# EAGLE design blocks-with-screens (EAGLE 9.1.2)
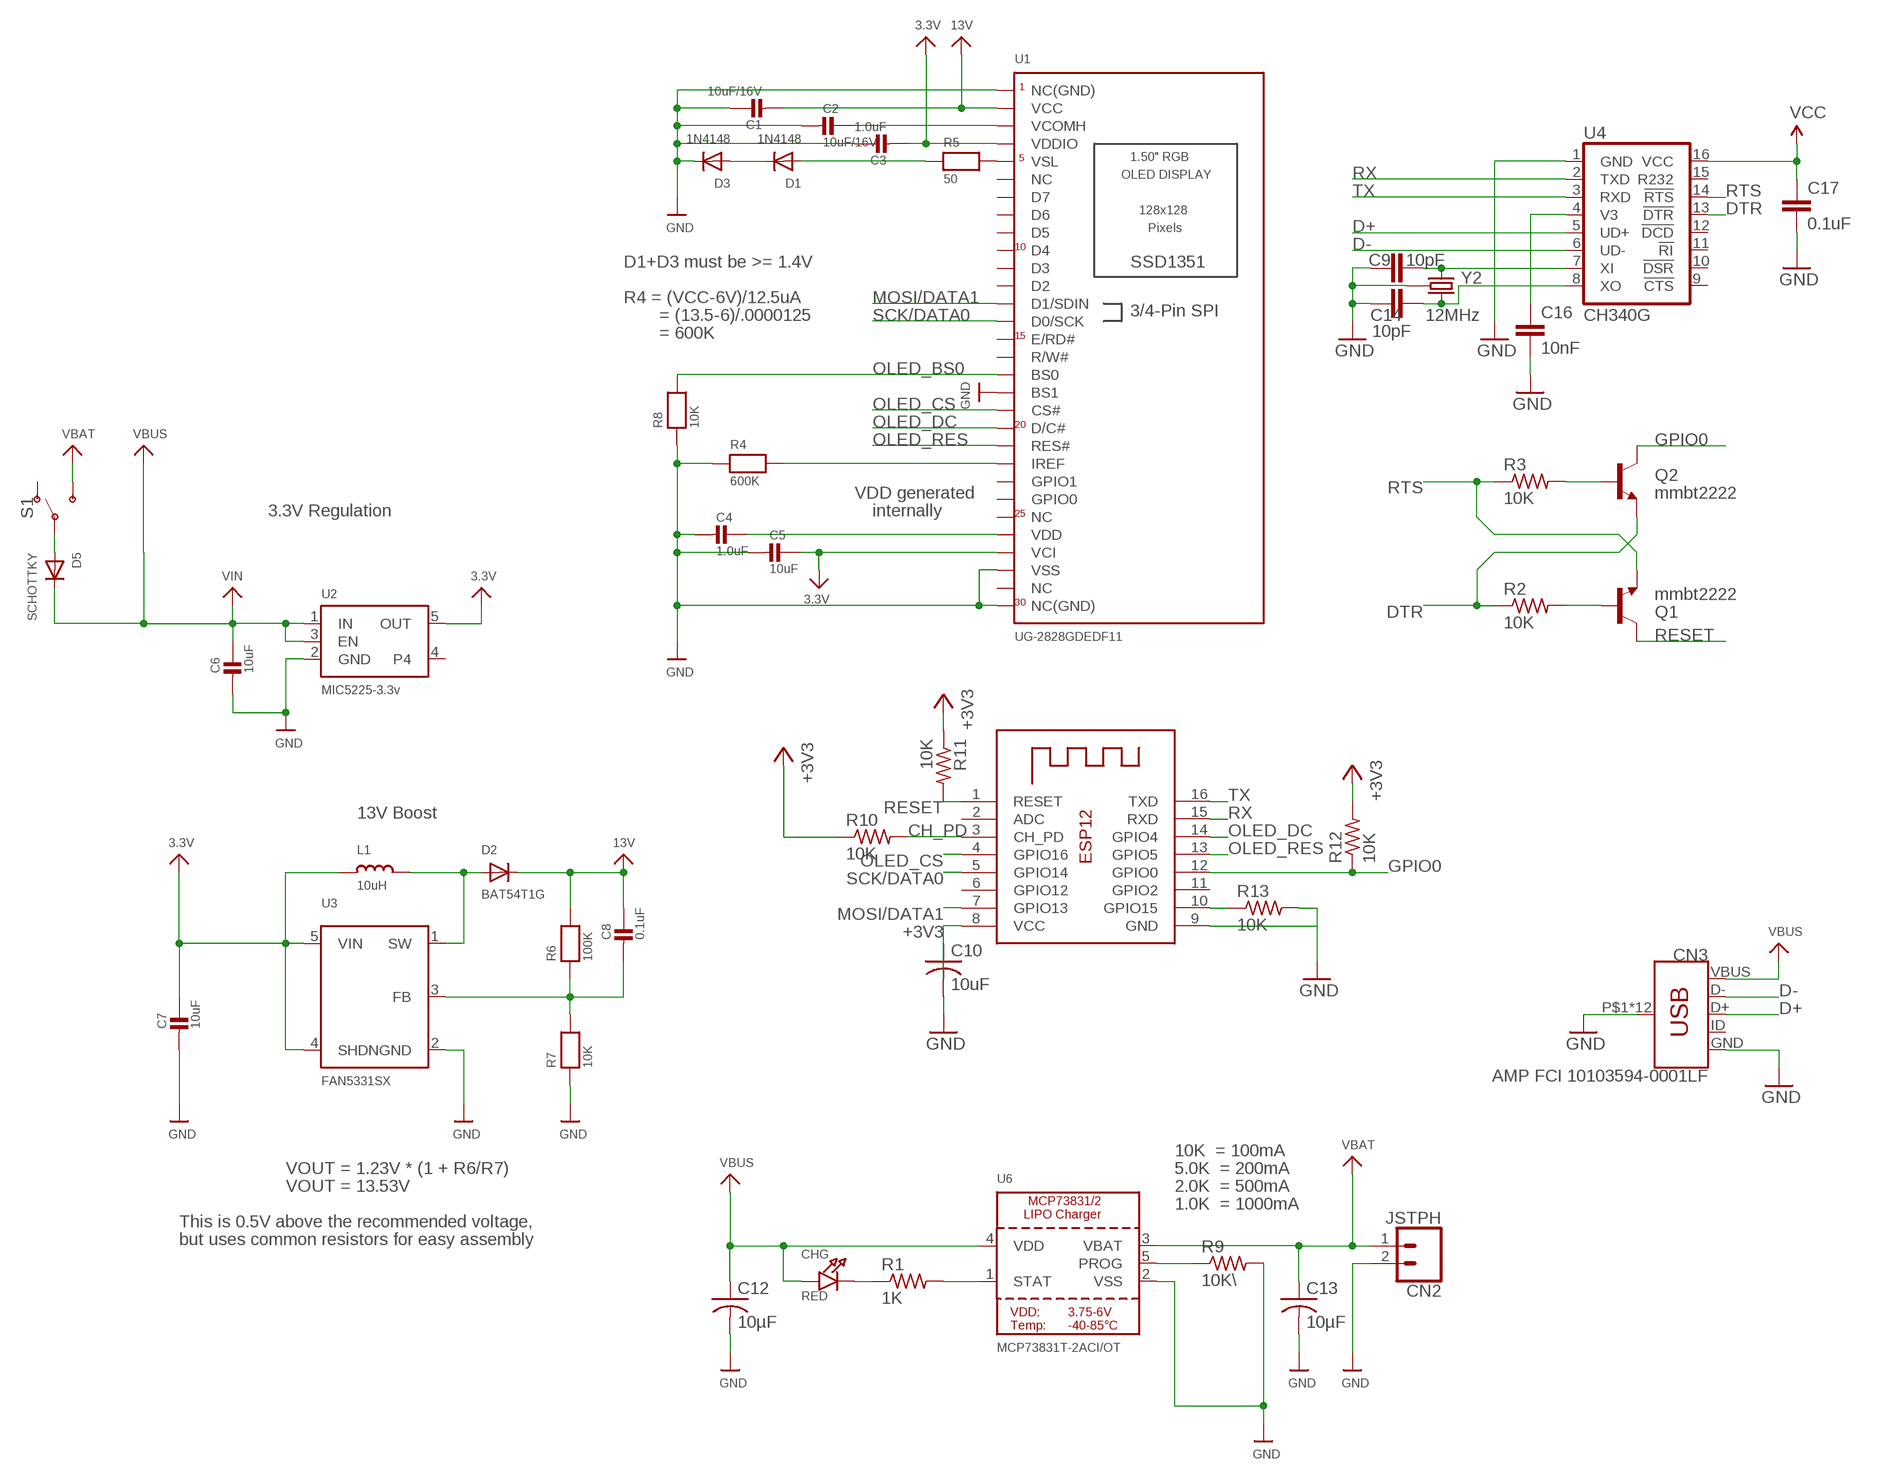
[diagram p0: schematic, sheet 1]

## Parts
C1  10uF/16V  CAP_CERAMIC0805  [0805]
C2  10uF/16V  CAP_CERAMIC0805  [0805]
C3  1.0uF  CAP_CERAMIC0805  [0805]
C4  1.0uF  CAP_CERAMIC0805  [0805]
C5  10uF  CAP_CERAMIC0805  [0805]
C6  10uF  CAP_CERAMIC0805  [0805]
C7  10uF  CAP_CERAMIC0805  [0805]
C8  0.1uF  CAP_CERAMIC0805  [0805]
C9  10pF  10PF-50V-5%(0603)  [0603-CAP]
C10  10uF  C-USC0805  [C0805]
C12  10µF  C-USC0805  [C0805]
C13  10µF  C-USC0805  [C0805]
C14  10pF  10PF-50V-5%(0603)  [0603-CAP]
C16  10nF  10NF/10000PF-50V-10%(0603)  [0603-CAP]
C17  0.1uF  0.1UF-25V(+80/-20%)(0603)  [0603-CAP]
CHG  RED  LED0805_NOOUTLINE  [CHIPLED_0805_NOOUTLINE]
CN2  JSTPH  CONN_02  [1X02]
CN3  AMP FCI 10103594-0001LF  USB_MICRO-B_HALF_PTH  [USB-MICROB-PTH]
D1  1N4148  DIODESOD-323  [SOD-323]
D2  BAT54T1G  DIODESOD-123  [SOD-123]
D3  1N4148  DIODESOD-323  [SOD-323]
D5  SCHOTTKY  DIODE_SOD-123FL  [SOD-123FL]
L1  10uH  INDUCTOR  [INDUCTOR_1007]
Q1  mmbt2222  TRANSISTOR_NPNSOT23-3  [SOT23-3]
Q2  mmbt2222  TRANSISTOR_NPNSOT23-3  [SOT23-3]
R1  1K  R-US_R0805  [R0805]
R2  10K  R-US_R0603  [R0603]
R3  10K  R-US_R0603  [R0603]
R4  600K  RESISTOR0805  [0805]
R5  50  RESISTOR0805  [0805]
R6  100K  RESISTOR0805  [0805]
R7  10K  RESISTOR0805  [0805]
R8  10K  RESISTOR0805  [0805]
R9  10K\  R-US_R0805  [R0805]
R10  10K  R-US_R0805  [R0805]
R11  10K  R-US_R0805  [R0805]
R12  10K  R-US_R0805  [R0805]
R13  10K  R-US_R0805  [R0805]
S1  SWITCH-SPDT-SMD-RIGHT-ANGLE  [SWITCH_SPST_SMD_A]
U1  UG-2828GDEDF11  DISP_OLED_UG-2828GDEDF11TOP  [FPC_XF2M-3015-1A]
U2  MIC5225-3.3v  VREG_SOT23-5  [SOT23-5]
U3  FAN5331SX  FAN5331  [SOT23-5@1]
U4  CH340G  CH340GSMD  [SO016]
U6  MCP73831T-2ACI/OT  MCP73831/2  [SOT23-5]
X1  ESP-12  [ESP-12]
Y2  12MHz  CRYSTAL-GROUNDED3.2X2.5  [CRYSTAL-SMD-3.2X2.5]

## Nets
3.3V: C3.2 C5.1 C7.1 L1.P$1 U1.P$4(VCI) U1.P$27(VDDIO) U2.5(OUT) U3.4(SHDN) U3.5(VIN)
13V: C1.2 C8.1 D2.C R6.2 U1.P$29(VCC)
+3V3 [power]: C10.1 R10.1 R11.1 R12.2 X1.8(VCC)
CH_PD: R10.2 X1.3(CH_PD)
D+: CN3.D+ U4.5(UD+)
D-: CN3.D- U4.6(UD-)
DTR: Q2.2(E) R2.1 U4.13(!DTR)
GND: C1.1 C2.2 C3.1 C4.2 C5.2 C6.2 C7.2 C9.1 C10.2 C12.2 C13.2 C14.1 C16.2 C17.2 CN2.2 CN3.GND CN3.P$1(SHIELD) CN3.P$2(SHIELD) CN3.P$3(SHIELD) CN3.P$4(SHIELD) CN3.P$6(SHIELD) CN3.P$8(SHIELD) CN3.P$10(SHIELD) CN3.P$12(SHIELD) CN3.SHEILD2(SHIELD) CN3.SHIELD CN3.SHIELD3(SHIELD) CN3.SHIELD4(SHIELD) D3.C R4.1 R7.1 R8.1 R9.2 R13.2 U1.P$1(NC(GND)) U1.P$3(VSS) U1.P$13(BS1) U1.P$30(NC(GND)) U2.2(GND) U3.2(GND) U4.1(GND) U6.2(VSS) X1.9(GND) Y2.2(GND) Y2.4(GND)
GPIO0: Q2.3(C) R12.1 X1.12(GPIO0)
IREF: R4.2 U1.P$9(IREF)
MOSI/DATA1: U1.P$18(D1/SDIN) X1.7(GPIO13)
N$1: CHG.C R1.1
N$3: C4.1 U1.P$5(VDD)
N$4: R1.2 U6.1(STAT)
N$5: D2.A L1.P$2 U3.1(SW)
N$6: R5.2 U1.P$26(VSL)
N$7: D1.A R5.1
N$8: C8.2 R6.1 R7.2 U3.3(FB)
N$9: R9.1 U6.5(PROG)
N$10: C14.2 U4.8(XO) Y2.3
N$11: D1.C D3.A
N$12: C9.2 U4.7(XI) Y2.1
N$13: Q1.1(B) R2.2
N$14: Q2.1(B) R3.2
N$17: R13.1 X1.10(GPIO15)
N$19 [power]: D5.A S1.2(P)
OLED_BS0: R8.2 U1.P$14(BS0)
OLED_CS: U1.P$12(CS#) X1.4(GPIO16)
OLED_DC: U1.P$11(D/C#) X1.14(GPIO4)
OLED_RES: U1.P$10(RES#) X1.13(GPIO5)
RESET: Q1.3(C) R11.2 X1.1(RESET)
RTS: Q1.2(E) R3.1 U4.14(!RTS)
RX: U4.2(TXD) X1.15(RXD)
SCK/DATA0: U1.P$17(D0/SCK) X1.5(GPIO14)
TX: U4.3(RXD) X1.16(TXD)
V3: C16.1 U4.4(V3)
VBAT [power]: C13.1 CN2.1 S1.3(S) U6.3(VBAT)
VBUS [power]: C6.1 C12.1 CHG.A CN3.VBUS D5.C U2.1(IN) U2.3(EN) U6.4(VDD) ; supply symbol labelled VIN
VCC: C17.1 U4.16(VCC)
VCOMH: C2.1 U1.P$28(VCOMH)
Unconnected: CN3.ID S1.1(O) U1.P$2(NC) U1.P$6(NC) U1.P$7(GPIO0) U1.P$8(GPIO1) U1.P$15(R/W#) U1.P$16(E/RD#) U1.P$19(D2) U1.P$20(D3) U1.P$21(D4) U1.P$22(D5) U1.P$23(D6) U1.P$24(D7) U1.P$25(NC) U2.4 U4.9(!CTS) U4.10(!DSR) U4.11(!RI) U4.12(!DCD) U4.15(R232) X1.2(ADC) X1.6(GPIO12) X1.11(GPIO2)

## Notes on the sheet
- D1+D3 must be >= 1.4V
- R4 = (VCC-6V)/12.5uA
- = (13.5-6)/.0000125
- = 600K
- VDD generated
- 3.3V Regulation | internally
- 13V Boost
- 10K  = 100mA
- VOUT = 1.23V * (1 + R6/R7) | 5.0K  = 200mA
- VOUT = 13.53V | 2.0K  = 500mA
- 1.0K  = 1000mA
- This is 0.5V above the recommended voltage,
- but uses common resistors for easy assembly

## Library data of the parts
C1-C8 = microbuilder:CAP_CERAMIC: Ceramic Capacitors For new designs, use the packages preceded by an '_' character since they are more reliable: The following footprints should be used on most boards: _0402 - Standard footprint for regular board layouts _0603 - Standard footprint for regular board layouts _0805 - Standard footprint for regular board layouts For extremely tight-pitch boards where space is at a premium, the following 'micro-pitch' footprints can be used (smaller pads, no silkscreen outline, etc.): _0402MP - Micro-pitch footprint for very dense/compact boards _0603MP - Micro-pitch footprint for very dense/compact boards _0805MP - Micro-pitch footprint for very dense/compact boards Commonly Stocked Parts 0402 - 0402 Surface Mount Capacitors 16pF 50V 5% [Digikey: 445-4899-2-ND] 18pF 50V 5% [Digikey: 490-1281-2-ND] 22pF 50V 5% [Digikey: 490-1283-2-ND] 68pF 50V 5% [Digikey: 490-1289-2-ND] 0.1uF 10V 10% [Digikey: 490-1318-2-ND] 1.0uF 6.3V 10% [Digikey: 490-1320-2-ND] 0603 - 0603 Surface Mount Capacitors 16 pF 50V 5% [Digikey: 445-5051-2-ND] 22 pF 50V [Digikey: PCC220ACVTR-ND] 33 pF 50V 5% [Digikey: 490-1415-1-ND] 56pF 50V 5% [Digikey: 490-1421-1-ND] 220pF 50V 5% [Digikey: 445-1285-1-ND] 680 pF 50V 2200 pF 50V 5% C0G [Digikey: 445-1297-1-ND] 5600 pF 100V 5% X7R [Digikey: 478-3711-1-ND] 0.1 µF 25V 10% [Digikey: PCC2277TR-ND] 0.22 µF 16V 10% X7R [Digikey: 445-1318-1-ND] 1.0 µF 25V 10% [Digikey: 445-5146-2-ND] 0603 - RF Specific 3pF 250V +/-0.1pF RF [Digikey: 712-1347-1-ND] 18 pF 250V 5% [Digikey: 478-3505-1-ND or 712-1322-1-ND] 56 pF 250V 5% C0G RF [Digikey: 490-4867-1-ND] 68 pF 250V RF [Digikey: 490-4868-1-ND] 0805 - 0805 Surface Mount Capacitors 220 pF 250V 2% RF Ceramic Capacitor [Digikey: 712-1398-1-ND] 1000 pF 50V 2% NP0 Ceramic Capacitor [Digikey: 478-3760-1-ND] 0.1 µF 25V 10% Ceramic Capacitor [Digikey: PCC1828TR-ND] 1.0 µF 16V 10% Ceramic Capacitor[Digikey: 490-1691-2-ND] 10.0 µF 10V 10% Ceramic Capacitor[Digikey: 709-1228-1-ND] 10.0 uF 16V 10% Ceramic Capacitor [Digikey: 478-5165-2-ND] 47 uF 6.3V 20% Ceramic Capacitor [Digikey: 587-1779-1-ND or 399-5506-1-ND] 1206 - 1206 Surface Mount Capacitors 47uF 10V 20% Ceramic Capacitor [Digikey: 490-5528-1-ND or 399-5508-1-ND or 445-6010-1-ND] 100uF 6.3V -20%, +80% Y5V Ceramic Capacitor (Digikey: 490-4512-1-ND, Mouser: 81-GRM31CF50J107ZE1L)
C9 C14 = SparkFun-Capacitors:10PF-50V-5%(0603): CAP-11812; PROD_ID: CAP-11812
C10 C12 C13 = adafruit:C-US: CAPACITOR, American symbol
C16 = SparkFun-Capacitors:10NF/10000PF-50V-10%(0603): CAP-00867; PROD_ID: CAP-00867
C17 = SparkFun-Capacitors:0.1UF-25V(+80/-20%)(0603): CAP-00810 Ceramic Standard decoupling cap; PROD_ID: CAP-00810
CHG = microbuilder:LED: LED 0603 - 0603 Surface Mount Package 2mA: Green LED - Low Power (3.9mcd, 2ma, 1.7Vf) - Digikey: 475-2709-2-ND Orange LED - Low Power (9.8mcd, 2ma, 1.8Vf) - Digikey: 475-1194-2-ND Red LED - Low Power (5mcd, 2ma, 1.8Vf) - Digikey: 475-1195-2-ND Yellow LED - Low Power (7mcd, 2ma, 1.8Vf) - Digikey: 475-1196-2-ND 5mA: Blue LED - Low Power (17mcd, 5ma, 2.9Vf) - Digikey: LNJ937W8CRACT-ND 0805 - 0805 Surface Mount Package 2mA: Red LED (8.8mcd, 2mA, 1.8Vf, Clear) - Low Power [Digikey: 475-2510-1-ND] Green LED (5mcd, 2mA, 1.8Vf, Clear) - Low Power [Digikey: 475-2730-1-ND] Yellow LED (11.3mcd, 2mA, 1.8Vf, Clear) - Low Power [Digikey: 475-2555-1-ND] 20mA: Red LED (104mcd, 20mA, Diffused) - LS R976 [Digikey: 475-1278-6-ND] Red LED (12mcd, 20mA, 2.0Vf, Clear) - APT2012EC [Digikey: 754-1128-1-ND] Green LED (15mcd, 20mA, 2.2Vf, Clear) - APT2012GC [Digikey: 754-1131-1-ND] Orange LED (160mcd, 20mA, 2.1Vf, Clear) - APT2012SECK [Digikey: 754-1130-1-ND] 1206 - 1206 Surface Mount Package Green LED (26mcd, 20mA, Diffused) - LG N971 [Digikey: 475-1407-6-ND] Red LED (15mcd, 20mA, Diffused) - LH N974 [Digikey: 475-1416-6-ND] Cree - Cree High-Power Surface Mount LEDs XPEBWT-L1-0000-00D50 - White 111lm 350mA 2.9Vf 6200K 110° XTEAWT-00-0000-00000LEE3 - White 114lm 350mA 2.85Vf 5000K 115° Everlight - Everlight 45-21 Series Surface Mount LEDs 45-21/QK2C-B2832AC2CB2/2T - Warm White 2000mcd 20mA 3.25Vf 3050K 120° 45-21/LK2C-B38452C4CB2/2T - Nuetral White 2000mcd 20mA 3.25Vf 4150K 120° 45-21/LK2C-B50634C6CB2/2T - Cold White 2200mcd 20mA 3.25Vf 5650K 120° PLCC2 Reverse Mount LS T77K-J1L2-1-0-2-R18-Z - Red 11.25mcd 2mA 1.8Vf 630nm 120° LO T77K-L1M2-24-Z - Orange 19.6mcd 2mA 1.8Vf 606nm 120° LY T77K-K2M1-26-Z - Yellow 15.7mcd 2mA 1.8Vf 587nm 120°
CN2 = SparkFun-Connectors:CONN_02: Multi connection point. Often used as Generic Header-pin footprint for 0.1 inch spaced/style header connections On any of the 0.1 inch spaced packages, you can populate with these: Break Away Headers - Straight <https://www.sparkfun.com/products/116> (PRT-00116) Break Away Male Headers - Right Angle <https://www.sparkfun.com/products/553> (PRT-00553) Female Headers <https://www.sparkfun.com/products/115> (PRT-00115) Break Away Headers - Machine Pin <https://www.sparkfun.com/products/117> (PRT-00117) Break Away Female Headers - Swiss Machine Pin <https://www.sparkfun.com/products/743> (PRT-00743) For SCREWTERMINALS and SPRING TERMINALS visit here: Screw Terimnals on SparkFun.com <https://www.sparkfun.com/search/results?term=Screw+Terminals> (5mm/3.5mm/2.54mm spacing) This device is also useful as a general connection point to wire up your design to another part of your project. Our various solder wires solder well into these plated through hole pads. Hook-Up Wire - Assortment (Stranded, 22 AWG) <https://www.sparkfun.com/products/11375> (PRT-11375) Hook-Up Wire - Assortment (Solid Core, 22 AWG) <https://www.sparkfun.com/products/11367> (PRT-11367) View the entire wire category on our website here <https://www.sparkfun.com/categories/141> Special notes: Molex polarized connector foot print use with: PRT-08233 with associated crimp pins and housings. 2.54_SCREWTERM for use with PRT-10571. 3.5mm Screw Terminal footprints for PRT-08084 5mm Screw Terminal footprints for use with PRT-08432
CN3 = SparkFun-Connectors:USB_MICRO-B: USB Type Micro-B Connector Male/female and PTH/SMT variants SparkFun Products: SparkFun microB USB Breakout <https://www.sparkfun.com/products/12035> SparkFun USB microB Plug Breakout <https://www.sparkfun.com/products/10031> SparkFun ESP8266 Thing <https://www.sparkfun.com/products/13231>; PROD_ID: CONN-13711
D1-D3 = microbuilder:DIODE: Diode
D5 = adafruit:DIODE: Diode
L1 = microbuilder:INDUCTOR: Inductors 0603: 10nH Ceramic Inductor - microwire antenna/RF (Digikey: 712-1434-2-ND) 0805: 560nH Ceramic Inductor - RF (Digikey: 553-1047-1-ND) 270nH Ceramic Inductor - Q = 40@250MHz, +-5%, 1 Ohm DC Resistance (Digikey: 535-10506-2-ND) 1007 (2518 Metric) SMT: 10µH 10% 250mOhm 820mA 1007 Inductor (Digikey: 587-2189-1-ND) 22µH 10% 500mOhm 580mA 1007 Inductor (Digikey: 587-2190-1-ND) 47µH 10% 950mOhm 420mA 1007 Inductor (Digikey: 587-2191-1-ND) 47µH 5% 100mOhm 1A 1008 Inductor (Digikey: 732-1816-1-ND) 5.0x5.0mm (Taiyo Yuden NR5040 Series) 6.8µH 20% 2.3A 64mOhm Inductor (Digikey: 587-2374-2-ND) 5.0x5.0mm (TDK VLC5045 Series) 4.7µH 20% 3.3A 34mOhm Inductor (Digikey: 445-6526-1-ND) 6.8µH 20% 2.7A 46mOhm Inductor (Digikey: 445-6527-1-ND) 6.0x6.0mm (TDK VLC6045 Series) 4.7µH 20% 3.8A 27mOhm Inductor (Digikey: 445-6538-2-ND) 6.8µH 20% 3A 41mOhm Inductor (Digikey: 445-6540-1-ND) 6.2µH 30% 2.2A 45mOhm Inductor (Digikey: SRR5028-6R2YCT-ND) - Not TDK VLC6045 but footprint should match 6.0x6.0mm (TDK SLF6045 Series) 6.8uH 30% 2A 33mOhm Inductor (Digikey: 445-4572-1-ND, Mouser: 810-SLF645T6R8N2R0PF) 6.0x6.0mm (Sumida CDRH5D28 Series) 6.2uH 30% 1.8A 45mOhm Inductor (Digikey: 308-1542-1-ND) Taiyo Yuden NR3015T2R2M - 2.2uH 20% 1.5A (Digikey: 587-1648-2-ND, Mouser: 963-NR3015T2R2M) - Used with TI TPS62172 CoilCraft RFID Transponder Coil - MA5532-AE (For use with AS3935 Lightning Sensor)
Q1 Q2 = SparkFun:TRANSISTOR_NPN: Transistor NPN BJT configuration in SOT23 package. MMBT2222 is the common NPN we use. Double check BCE configuration again layout.
R1-R3 R9-R13 = adafruit:R-US_: RESISTOR, American symbol
R4-R8 = microbuilder:RESISTOR: Resistors For new designs, use the packages preceded by an '_' character since they are more reliable: The following footprints should be used on most boards: _0402 - Standard footprint for regular board layouts _0603 - Standard footprint for regular board layouts _0805 - Standard footprint for regular board layouts For extremely tight-pitch boards where space is at a premium, the following 'micro-pitch' footprints can be used (smaller pads, no silkscreen outline, etc.): _0402MP - Micro-pitch footprint for very dense/compact boards _0603MP - Micro-pitch footprint for very dense/compact boards _0805MP - Micro-pitch footprint for very dense/compact boards
S1 = SparkFun-Switches:SWITCH-SPDT: Single Pole, Double Throw (SPDT) Switch Single-pole, double-throw (SPDT) switch. Variant Overview SMD-AYZ0202 Surface Mount DPDT Switch <https://www.sparkfun.com/products/597> (COM-00597) Used on e.g. LilyPad Arduino USB - ATmega32U4 Board <https://www.sparkfun.com/products/12049> PTH-11.6X4.0MM SPDT Mini Power Switch <https://www.sparkfun.com/products/102> (COM-00102) Used on e.g. SparkFun Simon Says - Through-Hole Soldering Kit <https://www.sparkfun.com/products/10547> (KIT-10547) PTH-11.6X4.0MM-KIT KIT version of SPDT Mini Power Switch - Simplifies soldering by removing tStop of switch pins - only one side can be soldered. PTH-11.6X4.0MM-LOCK LOCK version of SPDT Mini Power Switch - Offset pins hold switch in place for easier soldering. SMD-RIGHT-ANGLE Surface Mount Right Angle Switch <https://www.sparkfun.com/products/10860> (COM-10860) Used on e.g. SparkFun ESP8266 Thing <https://www.sparkfun.com/products/13231>; PROD_ID: SWCH-10651; SF_SKU: COM-10860
U1 = microbuilder:DISP_OLED_UG-2828GDEDF11: 128x128 1.5" RGB OLED - UG-2828GDEDF11 30-Pin 0.5mm Pitch FPC Cable (Top+Bottom Contacts) - OMRON XF2M-3015-1A (Digikey: OR723TR-ND) This FPC connector has contacts on the top and bottom, but the appropriate pin needs to be selected depending on whether the OLED will be inserted right-side up (use the TOP pinout) or upside-down (use the BOTTOM pinout).
U2 = microbuilder:VREG_SOT23-5: SOT23-5 Fixed Voltage Regulators Part Current Out V Out V In V Dropout θJA (°C/W) TJ (°C) Digikey Part No. ADP121 150mA 3.3V 3.4-5.5V 0.09V @ 150mA -- -- ADP121-AUJZ33R7CT-ND ADP121 150mA 3.0V 3.1-5.5V 0.09V @ 150mA -- -- ADP121-AUJZ30R7CT-ND ADP122 300mA 3.3V 3.4-5.5V 0.085V @ 300mA -- -- ADP122AUJZ-3.3-R7CT-ND ADP1712 300mA 3.3V 3.5-5.5V 0.17V @ 300mA -- -- ADP1712AUJZ-3.3-R7TR-ND AP7311 (Low Cost) 150mA 3.3V 3.5-6V 0.15V @ 150mA -- -- AP7311-33WG-7DICT-ND LD39015M18R 150mA 1.8V 1.9V-5.5V 0.08V @ 100mA -- -- 497-6977-1-ND LP2985A-33DBVR 150mA 3.3V 3.3-16V 0.28V @ 150mA 206 150 296-18479-1-ND MCP1824T-3302E/OT 300mA 3.3V 3.5V-6V 0.2V @ 300mA -- -- MCP1824T-3302E/OTCT-ND MIC5205-2.5YM5 TR 150mA 2.5V 2.7-16V 0.165V @ 150mA -- -- 576-1257-2-ND MIC5205-3.0YM5 TR 150mA 3.0V 3.2V-16V 0.165V @ 150mA -- -- 576-1258-2-ND MIC5205-3.3YM5 TR 150mA 3.3V 3.5V-16V 0.165V @ 150mA -- -- 576-1259-2-ND TPS780330220 150mA 3.3V+2.2V 3.6-5.5V 250mV Max -- -- 296-23332-1-ND TDA3663/N1,135 100mA 3.3V 3.5-45V 0.18V @ 50mA -- -- 568-5343-1-ND Max operating temp can be calculated using θJA, TJ (max junction temperature), and power in watts. Set the "Maximum Ambient Temperature" until it reaches TJ ("Max Junction Temperature"), which is the absolute limit for safe use of the regulator: Heat Sink Temperature Calculator <http://www.daycounter.com/Calculators/Heat-Sink-Temperature-Calculator.phtml> For example, With 12V source into a 3.3V LP2985 and a 30mA load, we are dissipating (12V-3.3V) * 0.03A = 0.261W. With a θJA of 206 °C/W, a TJ of 150°C, and 261mW we can safely use the chip without a heat sink up to 75°C (=147.1°C Junction Temperature).
U3 = microbuilder:FAN5331: FAN5331 - LED/OLED 20V Boost Converter Digikey: FAN5331SXCT-ND
U4 = SparkFun-DigitalIC:CH340G: A simple USB 2.0 to Serial IC.; PROD_ID: IC-13498
U6 = microbuilder:MCP73831/2: MCP73831/2 LIPO Charger VDD: 3.75 - 6V Temp -40 - 85°C Programmable Charge Rate: 15-500mA NOTE: STAT is a tri-state logic output on the MCP73831 and an open-drain output on the MCP73832. SOT23-5 with 4.2V output and tri-state logic on STAT = MCP73831T-2ACI/OT
X1 = adafruit:ESP-12
Y2 = USB Basic:CRYSTAL-GROUNDED: Small, 3.2x2.5mm, SMD Crystal; PROD_ID: XTAL-13518

## Net classes
1 power: width 0.406 mm

## Board
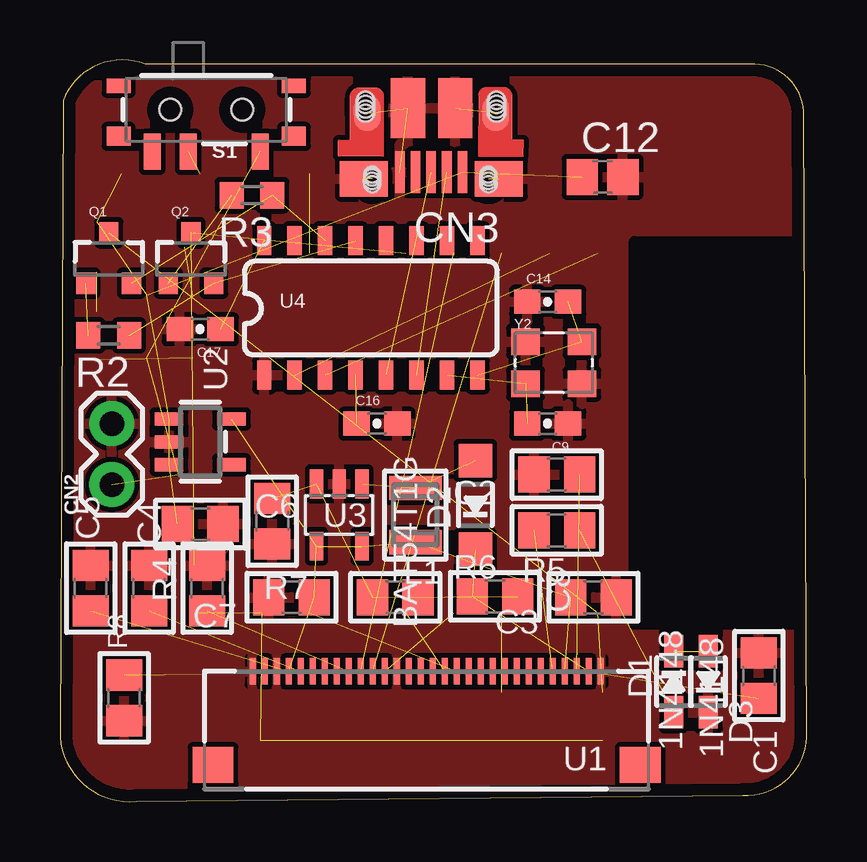
[diagram p1: board, top side]
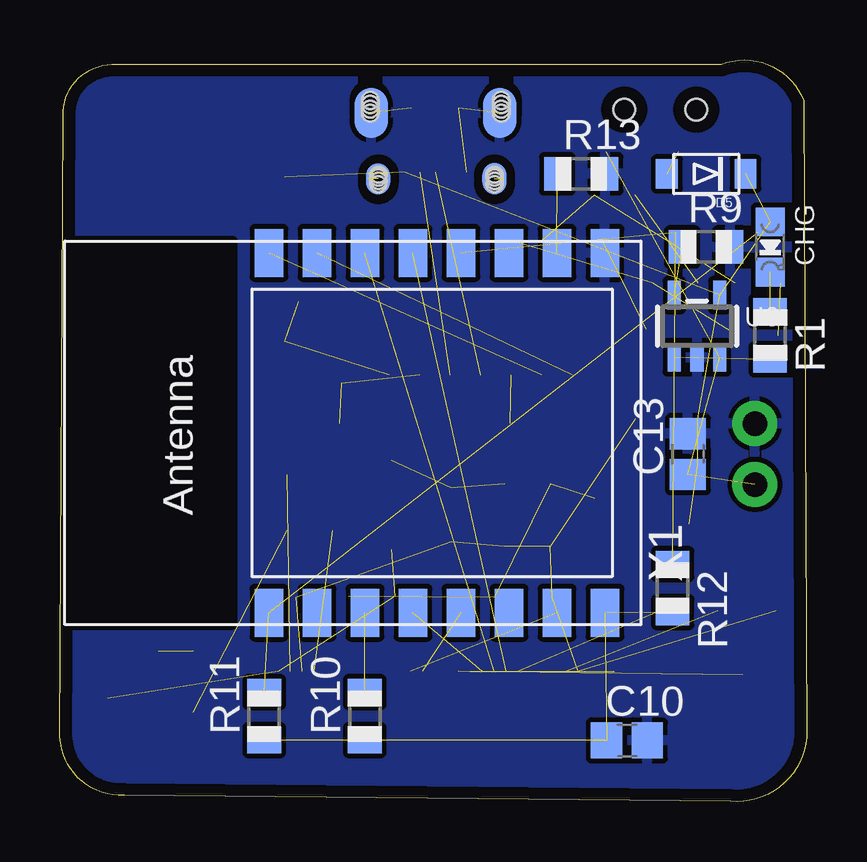
[diagram p2: board, bottom side, seen from below]

Size 31.11 x 30.92 mm. Coordinates in mm from the lower left corner, seen from the top.
Outline: 0.13,29.22 0,2.68 arc90 3.17,0.01 28.45,0.26 arc90 31.11,2.68 30.99,28.59 arc90 28.96,30.74 3.56,30.74 arc90 0.13,29.22
Copper layers (1*16): Top 0.035mm / dielectric 1.5mm / Bottom 0.035mm
Design rules "PCBCart-Standard *": minimum track width 8mil, minimum drill 0.4mm, track to track 8mil, track to pad 8mil, pad to pad 8mil, via to via 8mil, smd to smd 8mil, copper to edge 20mil, drill to drill 8mil, minimum pad ring 8mil, minimum via ring 10mil, stop-mask expansion 3mil, vias tented up to drill 20mil, thermal gap 8mil
bRestrict: area 45,46.8 to 45.2,47.3; area 46,47.6 to 46.5,47.9

### Footprints (pad centres in the part's own frame; a part is rotated, then mirrored left to right if it is on the bottom)
0805 = smd 1.3 x 1.5: 1 -0.95,0; 2 0.95,0
0603-CAP = smd 1.1 x 1: 1 -0.85,0; 2 0.85,0
C0805 = smd 1.3 x 1.5: 1 -0.85,0; 2 0.85,0
CHIPLED_0805_NOOUTLINE = smd 1.2 x 1.2: A 0,-1.05; C 0,1.05
1X02 = drill 1.016 pad 1.88: 1 0,0; 2 2.54,0
USB-MICROB-PTH = smd 0.4 x 1.75: D+ 0.031,1.331; D- -0.619,1.331; GND 1.331,1.331; ID 0.681,1.331; VBUS -1.269,1.331 | smd 1.4 x 2.1 bottom: P$1 2.701,-1.142; P$3 -2.659,-1.144 | smd 1 x 1.3: P$2 2.487,1.594; P$6 -2.368,1.604 | smd 1 x 1.3 bottom: P$4 -2.368,1.604; P$10 2.481,1.598 | smd 1.1 x 1.5: P$8 2.701,-1.142; P$12 -2.659,-1.144 | smd 2 x 1.46: SHEILD2 2.831,1.606; SHIELD -2.794,1.606 | smd 1.425 x 2.5: SHIELD3 -0.979,-1.349; SHIELD4 0.996,-1.352 | hole 0.7: -2.693,-1.134; -2.693,-1.3; -2.694,-1.499; -2.694,-1.664; 2.768,-1.134; 2.767,-1.303; 2.766,-1.496; 2.766,-1.664 | hole 0.66: -2.359,1.821; -2.349,1.691; -2.359,1.541; -2.354,1.432; 2.481,1.821; 2.491,1.691; 2.481,1.541; 2.486,1.432
SOD-323 = smd 1.35 x 0.8: A 1.27,0; C -1.27,0
SOD-123 = smd 1.4 x 1.4: A 1.85,0; C -1.85,0
SOD-123FL = smd 0.91 x 1.22: A 1.637,0; C -1.637,0
INDUCTOR_1007 = smd 1.016 x 2.2: P$1 -1.127,0; P$2 1.127,0
SOT23-3 = smd 0.8 x 0.9: 1 -0.95,-1; 2 0.95,-1; 3 0,1.1
R0805 = smd 1.1 x 1.4: 1 -1,0; 2 1,0
R0603 = smd 1 x 1.1: 1 -0.85,0; 2 0.85,0
SWITCH_SPST_SMD_A = smd 0.7 x 1.5: 1 -2.25,-1.75; 2 -0.75,-1.75; 3 2.25,-1.75 | smd 1 x 0.6: GND1 -3.65,1; GND3 3.65,1 | smd 1 x 0.8: GND2 -3.65,-1.1; GND4 3.65,-1.1 | hole 0.9: -1.5,0; 1.5,0
FPC_XF2M-3015-1A = smd 0.25 x 1.1: P$1 7.25,-2.63; P$2 6.75,-2.63; P$3 6.25,-2.63; P$4 5.75,-2.63; P$5 5.25,-2.63; P$6 4.75,-2.63; P$7 4.25,-2.63; P$8 3.75,-2.63; P$9 3.25,-2.63; P$10 2.75,-2.63; P$11 2.25,-2.63; P$12 1.75,-2.63; P$13 1.25,-2.63; P$14 0.75,-2.63; P$15 0.25,-2.63; P$16 -0.25,-2.63; P$17 -0.75,-2.63; P$18 -1.25,-2.63; P$19 -1.75,-2.63; P$20 -2.25,-2.63; P$21 -2.75,-2.63; P$22 -3.25,-2.63; P$23 -3.75,-2.63; P$24 -4.25,-2.63; P$25 -4.75,-2.63; P$26 -5.25,-2.63; P$27 -5.75,-2.63; P$28 -6.25,-2.63; P$29 -6.75,-2.63; P$30 -7.25,-2.63 | smd 1.7 x 1.5: SUPPORT1 8.9,1.27; SUPPORT2 -8.9,1.27
SOT23-5 = smd 0.55 x 1.2: 1 -0.95,-1.3; 2 0,-1.3; 3 0.95,-1.3; 4 0.95,1.3; 5 -0.95,1.3
SOT23-5@1 = smd 0.55 x 1.2: 1 -0.95,-1.3; 2 0,-1.3; 3 0.95,-1.3; 4 0.95,1.3; 5 -0.95,1.3
SO016 = smd 0.6 x 1.2: 1 -4.445,-2.8; 2 -3.175,-2.8; 3 -1.905,-2.8; 4 -0.635,-2.8; 5 0.635,-2.8; 6 1.905,-2.8; 7 3.175,-2.8; 8 4.445,-2.8; 9 4.445,2.8; 10 3.175,2.8; 11 1.905,2.8; 12 0.635,2.8; 13 -0.635,2.8; 14 -1.905,2.8; 15 -3.175,2.8; 16 -4.445,2.8
ESP-12 = smd 2 x 1.2: 1 -7.5,4.5; 2 -7.5,2.5; 3 -7.5,0.5; 4 -7.5,-1.5; 5 -7.5,-3.5; 6 -7.5,-5.5; 7 -7.5,-7.5; 8 -7.5,-9.5; 9 7.5,-9.5; 10 7.5,-7.5; 11 7.5,-5.5; 12 7.5,-3.5; 13 7.5,-1.5; 14 7.5,0.5; 15 7.5,2.5; 16 7.5,4.5
CRYSTAL-SMD-3.2X2.5 = smd 1.2 x 1.1: 1 -1.175,-0.875; 2 1.175,-0.875; 3 1.175,0.875; 4 -1.175,0.875

### Placement (x,y rotation side)
C1  29.12,5.25 270 top
C2  20.7,13.64 180 top
C3  22.23,8.52 180 top
C4  3.71,8.9 90 top
C5  1.27,8.9 90 top
C6  5.84,11.57 0 top
C7  9.65,8.52 180 top
C8  18.12,8.56 0 top
C9  20.32,15.76 180 top
C10  7.49,2.55 0 bottom
C12  22.61,26.05 0 top
C13  4.95,14.49 90 bottom
C14  20.32,20.84 0 top
C16  13.21,15.76 0 top
C17  5.84,19.7 180 top
CHG  1.52,23.12 180 bottom
CN2  2.16,13.22 90 top
CN3  15.49,27.57 180 top
D1  25.57,5 270 top
D2  17.31,12.37 90 top
D3  27.01,5 90 top
D5  4.19,26.17 180 bottom
L1  14.81,11.95 90 top
Q1  2.03,22.62 0 top
Q2  5.46,22.62 0 top
R1  1.52,19.44 270 bottom
R2  2.03,19.44 180 top
R3  8,25.28 180 top
R4  6.13,8.9 270 top
R5  20.7,11.31 180 top
R6  13.97,8.52 0 top
R7  8.84,11.69 90 top
R8  2.67,4.33 90 top
R9  4.19,23.12 0 bottom
R10  18.41,3.57 90 bottom
R11  22.61,3.57 90 bottom
R12  5.59,8.9 270 bottom
R13  9.4,26.17 0 bottom
S1  6.1,28.84 0 top
U1  15.28,2.8 180 top
U2  5.84,15 270 top
U3  11.63,11.95 180 top
U4  12.95,20.58 0 top
U6  4.57,19.82 0 bottom
X1  17.91,15.38 90 bottom
Y2  20.57,18.3 0 top

### Tracks (layer width: path | path; a pad name or v marks a point on that pad's centre or on a via)
3.3V  (8 unrouted)
13V  (4 unrouted)
+3V3  (4 unrouted)
CH_PD  (1 unrouted)
D+  (1 unrouted)
D-  (1 unrouted)
DTR  (2 unrouted)
GND  (11 unrouted)
  pour Bottom (isolate 0.203): 43.23,42.26 -0.16,42.26 -0.28,-0.12 43.49,0.26
  pour Top (isolate 0.203): 43.23,42.26 0.09,42.26 -0.28,0.01 43.49,0.39
GPIO0  (2 unrouted)
IREF  (1 unrouted)
MOSI/DATA1  (1 unrouted)
N$1  (1 unrouted)
N$3  (1 unrouted)
N$4  (1 unrouted)
N$5  (2 unrouted)
N$6  (1 unrouted)
N$7  (1 unrouted)
N$8  (3 unrouted)
N$9  (1 unrouted)
N$10  (2 unrouted)
N$11  (1 unrouted)
N$12  (2 unrouted)
N$13  (1 unrouted)
N$14  (1 unrouted)
N$17  (1 unrouted)
N$19  (1 unrouted)
OLED_BS0  (1 unrouted)
OLED_CS  (1 unrouted)
OLED_DC  (1 unrouted)
OLED_RES  (1 unrouted)
RESET  (2 unrouted)
RTS  (2 unrouted)
RX  (1 unrouted)
SCK/DATA0  (1 unrouted)
TX  (1 unrouted)
V3  (1 unrouted)
VBAT  (3 unrouted)
VBUS  (7 unrouted)
VCC  (1 unrouted)
VCOMH  (1 unrouted)